# EAGLE schematic usb-microphone-v0001 (EAGLE 9.3.2)
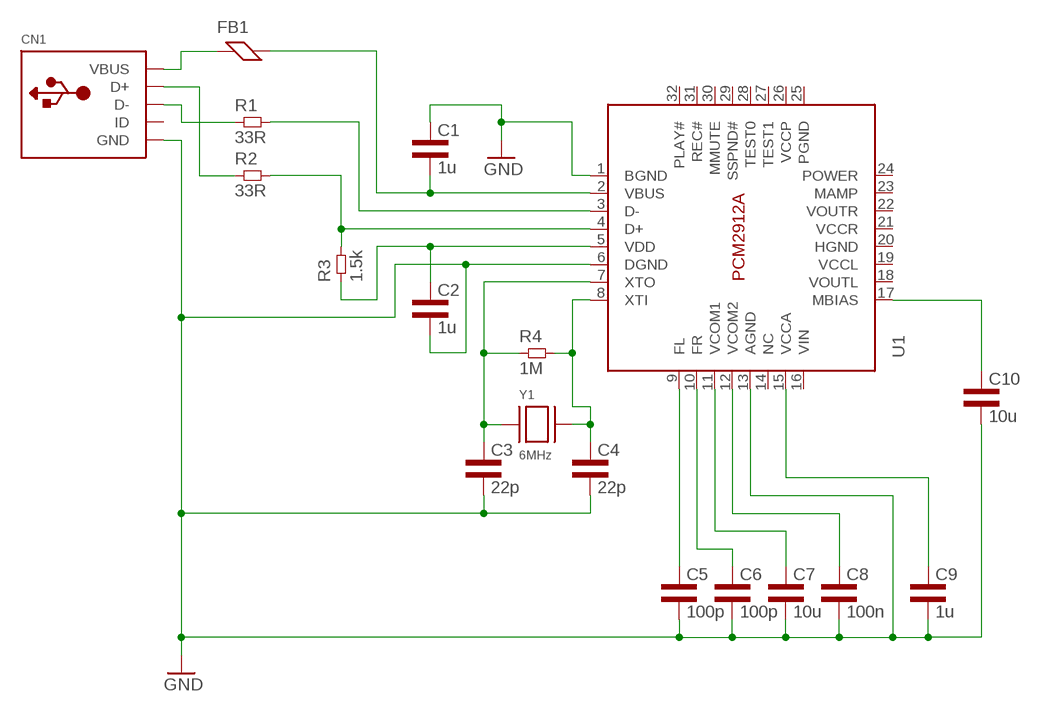
[diagram p0: schematic, sheet 1]

## Parts
C1  1u  CAP0603L3  [0603L3]
C2  1u  CAP0603L3  [0603L3]
C3  22p  CAP0603L3  [0603L3]
C4  22p  CAP0603L3  [0603L3]
C5  100p  CAP0603L3  [0603L3]
C6  100p  CAP0603L3  [0603L3]
C7  10u  CAP0805L3  [0805L3]
C8  100n  CAP0603L3  [0603L3]
C9  1u  CAP0603L3  [0603L3]
C10  10u  CAP0805L3  [0805L3]
CN1  ADAFRUIT_USBMINIB  [ADAFRUIT_USB-MINIB]
FB1  FERRITE0805L3  [0805L3]
R1  33R  RES0603L3  [0603L3]
R2  33R  RES0603L3  [0603L3]
R3  1.5k  RES0603L3  [0603L3]
R4  1M  RES0603L3  [0603L3]
U1  PCM2912A  [S-PQFP-N32]
Y1  6MHz  CRYSTALSMD-11.7X4.8  [SMD-11.7X4.8]

## Nets
GND: C1.P$1 C2.P$2 C3.P$2 C4.P$2 C5.P$2 C6.P$2 C7.2 C8.P$2 C9.P$2 C10.2 CN1.GND U1.1(BGND) U1.6(DGND) U1.13(AGND)
N$1: R1.P$2 U1.3(D-)
N$2: R2.P$2 R3.P$2 U1.4(D+)
N$3: C1.P$2 FB1.2 U1.2(VBUS)
N$4: CN1.D+ R2.P$1
N$5: CN1.D- R1.P$1
N$6: CN1.VBUS FB1.1
N$7: C3.P$1 R4.P$1 U1.7(XTO) Y1.1
N$8: C2.P$1 R3.P$1 U1.5(VDD)
N$9: C4.P$1 R4.P$2 U1.8(XTI) Y1.4
N$10: C5.P$1 U1.9(FL)
N$11: C6.P$1 U1.10(FR)
N$12: C7.1 U1.11(VCOM1)
N$13: C8.P$1 U1.12(VCOM2)
N$14: C9.P$1 U1.15(VCCA)
N$16: C10.1 U1.17(MBIAS)
Unconnected: CN1.ID U1.14(NC) U1.16(VIN) U1.18(VOUTL) U1.19(VCCL) U1.20(HGND) U1.21(VCCR) U1.22(VOUTR) U1.23(MAMP) U1.24(POWER) U1.25(PGND) U1.26(VCCP) U1.27(TEST1) U1.28(TEST0) U1.29(SSPND#) U1.30(MMUTE) U1.31(REC#) U1.32(PLAY#)

## Library data of the parts
C1-C10 = common:CAP
CN1 = my_dac_amp:ADAFRUIT_USB: USB Connectors USBMINIB - Surface Mount Female Mini-B USB Connector 4UConnector: 06564 By microbuilder.eu Thru-hole RA Female Mini-B USB Connector 4UConnector: 18732 By ladyada.net
FB1 = common:FERRITE
R1-R4 = common:RES
U1 = common:PCM2912A
Y1 = common:CRYSTAL